# Altium schematic sheet Encoder.SchDoc
size A4; SheetNumber: 5; SheetTotal: 6
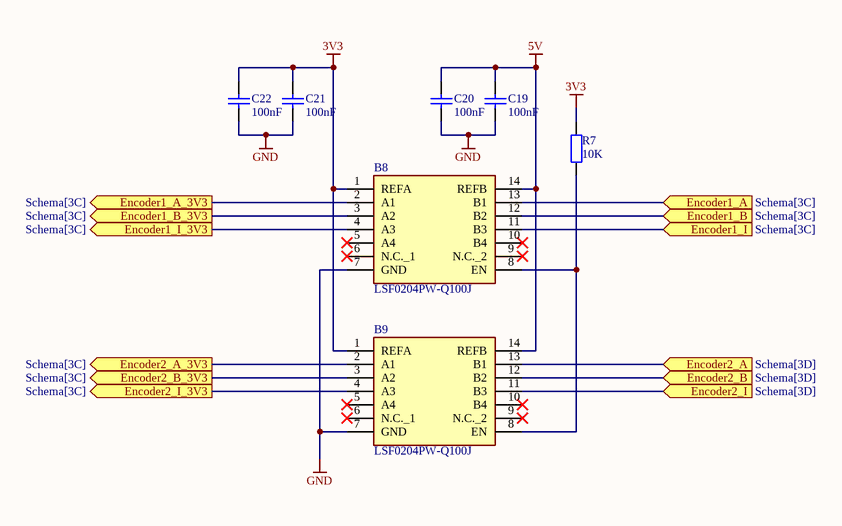
[diagram p0: Encoder.SchDoc]

## Parts
B8  LSF0204PW-Q100J  [SOP65P640X110-14M]
B9  LSF0204PW-Q100J  [SOP65P640X110-14M]
C19  value 100nF  [0805_Lorin]  (hidden comment: Cap)
C20  value 100nF  [0805_Lorin]  (hidden comment: Cap)
C21  value 100nF  [0805_Lorin]  (hidden comment: Cap)
C22  value 100nF  [0805_Lorin]  (hidden comment: Cap)
R7  value 10K  [0805_Lorin]  (hidden comment: Res2)

## Ports
Encoder1_A (in, see Schema[3C]), Encoder1_A_3V3 (out, see Schema[3C]), Encoder1_B (in, see Schema[3C]), Encoder1_B_3V3 (out, see Schema[3C]), Encoder1_I (in, see Schema[3C]), Encoder1_I_3V3 (out, see Schema[3C]), Encoder2_A (in, see Schema[3D]), Encoder2_A_3V3 (out, see Schema[3C]), Encoder2_B (in, see Schema[3D]), Encoder2_B_3V3 (out, see Schema[3C]), Encoder2_I (in, see Schema[3D]), Encoder2_I_3V3 (out, see Schema[3C])

## Nets
3V3: B8.1(REFA) B9.1(REFA) C21.2 C22.2 R7.2
5V: B8.14(REFB) B9.14(REFB) C19.2 C20.2
GND: B8.7(GND) B9.7(GND) C19.1 C20.1 C21.1 C22.1
Encoder1_A: B8.13(B1) ; port Encoder1_A
Encoder1_A_3V3: B8.2(A1) ; port Encoder1_A_3V3
Encoder1_B: B8.12(B2) ; port Encoder1_B
Encoder1_B_3V3: B8.3(A2) ; port Encoder1_B_3V3
Encoder1_I: B8.11(B3) ; port Encoder1_I
Encoder1_I_3V3: B8.4(A3) ; port Encoder1_I_3V3
Encoder2_A: B9.13(B1) ; port Encoder2_A
Encoder2_A_3V3: B9.2(A1) ; port Encoder2_A_3V3
Encoder2_B: B9.12(B2) ; port Encoder2_B
Encoder2_B_3V3: B9.3(A2) ; port Encoder2_B_3V3
Encoder2_I: B9.11(B3) ; port Encoder2_I
Encoder2_I_3V3: B9.4(A3) ; port Encoder2_I_3V3
NetB8_8: B8.8(EN) B9.8(EN) R7.1

Not connected (* = marked no-connect by the designer): B8 5(A4)* 6(N.C._1)* 9(N.C._2)* 10(B4)*; B9 5(A4)* 6(N.C._1)* 9(N.C._2)* 10(B4)*

## Library data of the parts
B8 B9 = LSF0204PW-Q100J: Translation - Voltage Levels ANALOG & LOGIC ICS; Manufacturer_Name: Nexperia; Geometry.Height: 1.1mm; Mouser Part Number: 771-LSF0204PW-Q100J; Mouser Price/Stock: https://www.mouser.co.uk/ProductDetail/Nexperia/LSF0204PW-Q100J?qs=DPoM0jnrROXA8naUdxkzeA%3D%3D; Manufacturer_Part_Number: LSF0204PW-Q100J; Datasheet Link: https://assets.nexperia.com/documents/data-sheet/LSF0204_Q100.pdf
C19-C22 = Cap: Capacitor; Published: 8-Jun-2000; LatestRevisionDate: 17-Jul-2002; LatestRevisionNote: Re-released for DXP Platform.; PackageReference: RAD-0.3; Publisher: Altium Limited; PackageDescription: Radial Cap, Thru-Hole; 2 Leads; 0.3 in Pin Spacing
R7 = Res2: Resistor; Published: 8-Jun-2000; LatestRevisionDate: 17-Jul-2002; LatestRevisionNote: Re-released for DXP Platform.; PackageReference: AXIAL-0.4; Publisher: Altium Limited; PackageDescription: Axial Device, Thru-Hole; 2 Leads; 0.4 in Pin Spacing